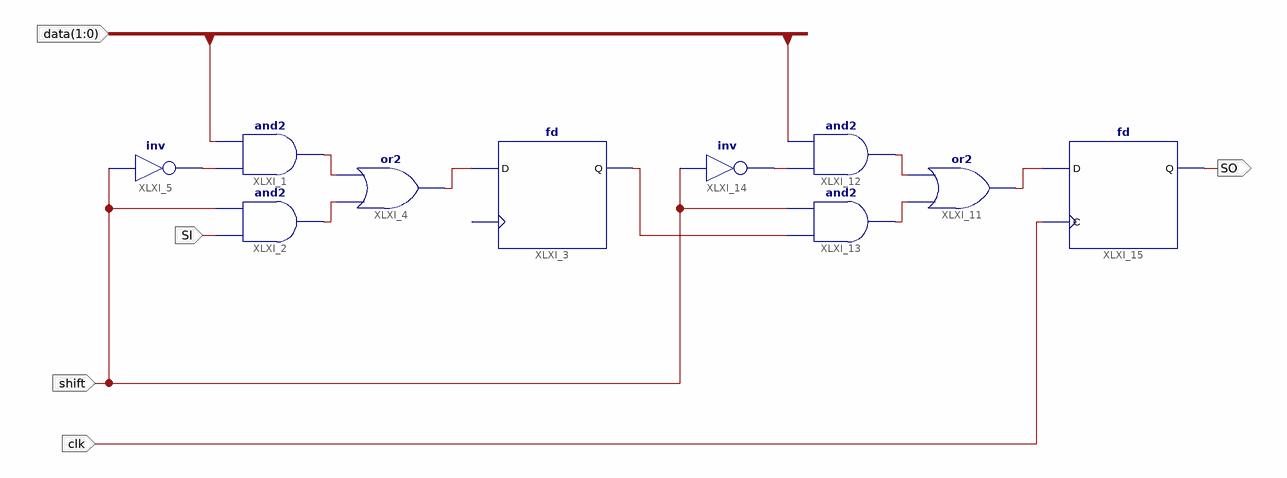
[diagram p0: schematic sheet 1]
// Xilinx ISE schematic piso2.sch (spartan6) as structural Verilog: 10 symbols, 5 ports
module piso2 (
  input  shift,
  input  [1:0] data,
  input  clk,
  input  SI,
  output SO
);

  wire XLXN_1, XLXN_2, XLXN_6, XLXN_7, XLXN_19, XLXN_21, XLXN_22, XLXN_24, XLXN_27;

  and XLXI_1 (XLXN_1, XLXN_7, data[0]);
  and XLXI_2 (XLXN_2, SI, shift);
  fd XLXI_3 (.D(XLXN_6), .Q(XLXN_27));  // open: C
  or XLXI_4 (XLXN_6, XLXN_2, XLXN_1);
  not XLXI_5 (XLXN_7, shift);
  or XLXI_11 (XLXN_24, XLXN_21, XLXN_19);
  and XLXI_12 (XLXN_19, XLXN_22, data[1]);
  and XLXI_13 (XLXN_21, XLXN_27, shift);
  not XLXI_14 (XLXN_22, shift);
  fd XLXI_15 (.C(clk), .D(XLXN_24), .Q(SO));
endmodule
